# EAGLE design left (EAGLE 9.6.2)
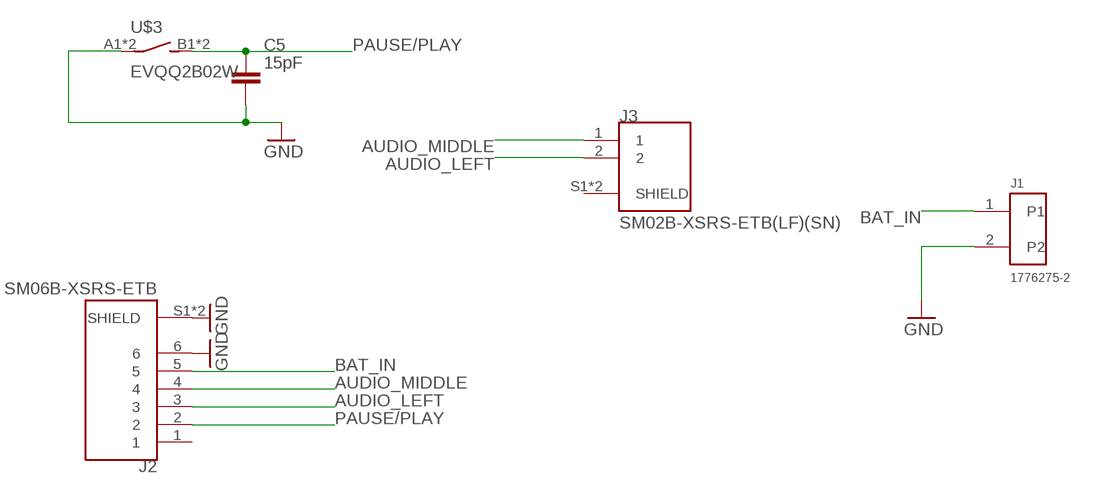
[diagram p0: schematic, sheet 1]

## Parts
C5  15pF  C_CHIP-0805(2012-METRIC)  [CAPC2012X110]
J1  1776275-2  [TE_1776275-2]
J2  SM06B-XSRS-ETB  [JST_SM06B-XSRS-ETB]
J3  SM02B-XSRS-ETB(LF)(SN)  [JST_SM02B-XSRS-ETB(LF)(SN)]
U$3  EVQQ2B02W  [EVQQ2B02W]

## Nets
AUDIO_LEFT: J2.3 J3.2
AUDIO_MIDDLE: J2.4 J3.1
BAT_IN: J1.1 J2.5
GND: C5.2 J1.2 J2.6 J2.S1(SHIELD) J2.S2(SHIELD) U$3.A1(P) U$3.A2(P)
PAUSE/PLAY: C5.1 J2.2 U$3.B1(S) U$3.B2(S)
Unconnected: J2.1 J3.S1(SHIELD) J3.S2(SHIELD)

## Library data of the parts
C5 = Capacitor:C: Capacitor - Generic; CATEGORY: Capacitor
J1 = open_earphones:1776275-2: TERM BLOCK 2POS SIDE ENT 3.5MM Check prices <https://pricing.snapeda.com/parts/1776275-2/TE%20Connectivity/view-part?ref=eda>; AVAILABILITY: Good; CENTERLINE_PITCH: 3.5 mm[.138 in]; COMMENT: 1776275-2; DESCRIPTION: Conn Terminal Block 2 POS 3.5mm Solder ST Thru-Hole 7A/Contact; EU_ROHS_COMPLIANCE: Compliant with Exemptions; MF: TE Connectivity; MP: 1776275-2; NUMBER_OF_POSITIONS: 2; PACKAGE: None; PRICE: None; PURCHASE-URL: https://pricing.snapeda.com/search/part/1776275-2/?ref=eda
J2 = open_earphones:SM06B-XSRS-ETB: CONN HEADER SMD R/A 6POS 0.6MM; MANUFACTURER: JST; STANDARD: Manufacturer Recommendations
J3 = open_earphones:SM02B-XSRS-ETB(LF)(SN): CONN HEADER SMD R/A 2POS 0.6MM; MANUFACTURER: JST; STANDARD: Manufacturer Recommendations
U$3 = open_earphones:EVQQ2B02W

## Board
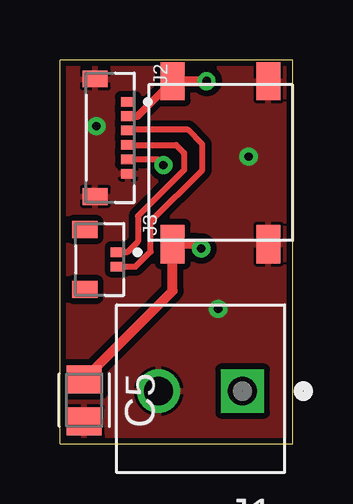
[diagram p1: board, top side]
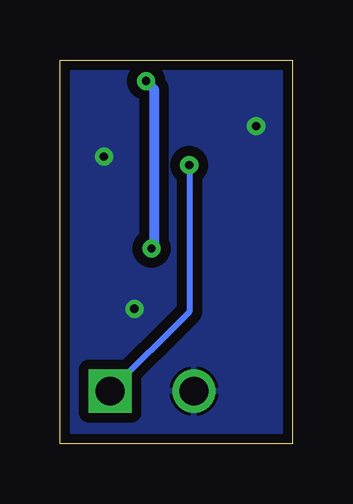
[diagram p2: board, bottom side, seen from below]

Size 9.71 x 16 mm. Coordinates in mm from the lower left corner, seen from the top.
Outline: 0,0 9.71,0 9.71,16 0,16 0,0
Copper layers (1*16): Top 0.035mm / dielectric 0.73mm / Bottom 0.035mm
Design rules "default *": minimum track width 6mil, minimum drill 0.35mm, track to track 6mil, track to pad 6mil, pad to pad 6mil, via to via 6mil, smd to smd 6mil, copper to edge 0.1mm, drill to drill 1mil, minimum pad ring 10mil, minimum via ring 8mil, stop-mask expansion 0mil, vias tented up to drill 0mil, thermal gap 5mil

### Footprints (pad centres in the part's own frame; a part is rotated, then mirrored left to right if it is on the bottom)
CAPC2012X110 = smd 1.165 x 1.465: 1 -0.875,0; 2 0.875,0
TE_1776275-2 = drill 1.2 square: 1 0,0 | drill 1.2: 2 3.5,0
JST_SM06B-XSRS-ETB = smd 0.4 x 0.6: 1 -1.5,1.375; 2 -0.9,1.375; 3 -0.3,1.375; 4 0.3,1.375; 5 0.9,1.375; 6 1.5,1.375 | smd 0.7 x 1.05: S1 -2.45,0; S2 2.45,0
JST_SM02B-XSRS-ETB(LF)(SN) = smd 0.4 x 0.6: 1 -0.3,1.375; 2 0.3,1.375 | smd 0.7 x 1.05: S1 -1.25,0; S2 1.25,0
EVQQ2B02W = smd 1.6 x 1: A1 -3.4,-2; A2 3.4,-2; B1 -3.4,2; B2 3.4,2

### Placement (x,y rotation side)
C5  1.02,1.81 270 top
J1  7.62,2.19 180 top
J2  1.47,12.76 270 top
J3  1.04,7.68 270 top
U$3  6.71,11.72 90 top

### Tracks (layer width: path | path; a pad name or v marks a point on that pad's centre or on a via)
AUDIO_LEFT
  Top 0.254: J3.2 3.15,7.38 3.78,8.01 3.78,9.25 5.94,11.41 5.94,12.48 5.33,13.09 2.88,13.09 J2.3
AUDIO_MIDDLE
  Top 0.254: J2.4 4.85,12.46 5.18,12.12 5.18,11.41 3.25,9.48 3.25,8.43 2.8,7.98 J3.1
BAT_IN  (via drill 0.35)
  Top 0.254: J2.5 4.07,11.86 v4.32,11.61
  Bottom 0.254: J1.1 4.32,5.49 v4.32,11.61
GND  (via drill 0.35)
  other vias: 1.52,13.24 7.87,11.97 6.6,5.62
  pour Top (isolate 0.254): -0.3,-2.28 -0.3,16.19 10.01,16.19 10.01,-2.28
  pour Bottom (isolate 0.406): 10.01,-2.28 10.01,16.24 -0.33,16.24 -0.33,-2.28
PAUSE/PLAY  (via drill 0.35)
  Top 0.305: 5.19,15.12 U$3.B2 3.25,13.66 J2.2
  Top 0.406: C5.1 4.71,6.38 U$3.B1 5.71,8.32 v5.89,8.13 | U$3.B2 v6.12,15.12
  Bottom 0.406: v6.12,15.12 5.79,14.79 5.79,8.13 v5.89,8.13